# Altium schematic sheet Relay3_Block.SchDoc
size A4; CheckedBy: CT-Energys; Author: CT-Energys; CompanyName: HTD COMPANY LIMITED; DrawnBy: CHITOAN; Engineer: CHITOAN; Organization: Altium Limited; Address1: HO CHI MINH CITY; Address2: VIETNAM
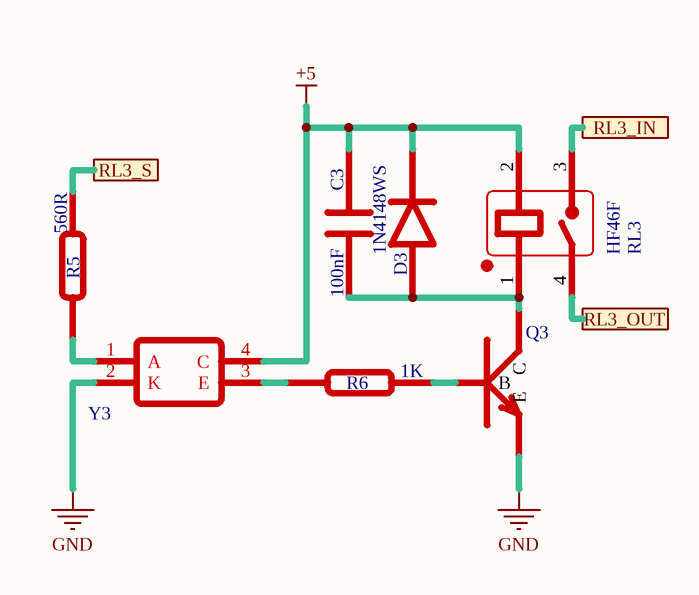
[diagram p0: Relay3_Block.SchDoc]

## Parts
C3  100nF  [C0805]
D3  1N4148WS  [SMA]
Q3  S8050  [SOT-23]  (value not drawn)
R5  560R  [R0603]
R6  1K  [R0603]
RL3  HF46F  [HF-46-X]
Y3  PHOTOCOUPLER  [SOP-4]  (value not drawn)

## Ports
RL3_IN, RL3_OUT, RL3_S

## Nets
+5: C3.2 D3.K RL3.2 Y3.4(C)
GND: Q3.2(E) Y3.2(K)
RL3_IN: RL3.3 ; port RL3_IN
RL3_OUT: RL3.4 ; port RL3_OUT
RL3_S: R5.1 ; port RL3_S
NetC3_1: C3.1 D3.A Q3.3(C) RL3.1
NetQ3_1: Q3.1(B) R6.1
NetR5_2: R5.2 Y3.1(A)
NetR6_2: R6.2 Y3.3(E)

## Notes on the sheet
- Title
- Size:
- Date:
- A4
- Number:
- Time:
- Revision:
- Design by:
- Company:
- File:

## Library data of the parts
C3 = CAP-CER: Ceramic Capacitor
D3 = 1N4148WS: Small Signal Diode
Q3 = S8050: NPN Transistors 0.5A Collector to Emitter 25V
R5 R6 = Resistor
RL3 = HF46F: Relay 4 Pin; ComponentLink1Description: HF-46F; ComponentLink1URL: https://source.hongfa.com/pdf/web/viewer.html?file=/Uploads/Product/PDF/HF46F_en.pdf
Y3 = PC817: Photo-Coupler; ComponentLink1Description: PC817; ComponentLink1URL: https://www.socle-tech.com/doc/IC%20Channel%20Product/Optoelectronic%20Components/Photocoupler/PC8171_NIP1B_ED-16P023.pdf